# Altium schematic sheet Phase Inverter.SchDoc
size A; SheetNumber: 4; SheetTotal: 4
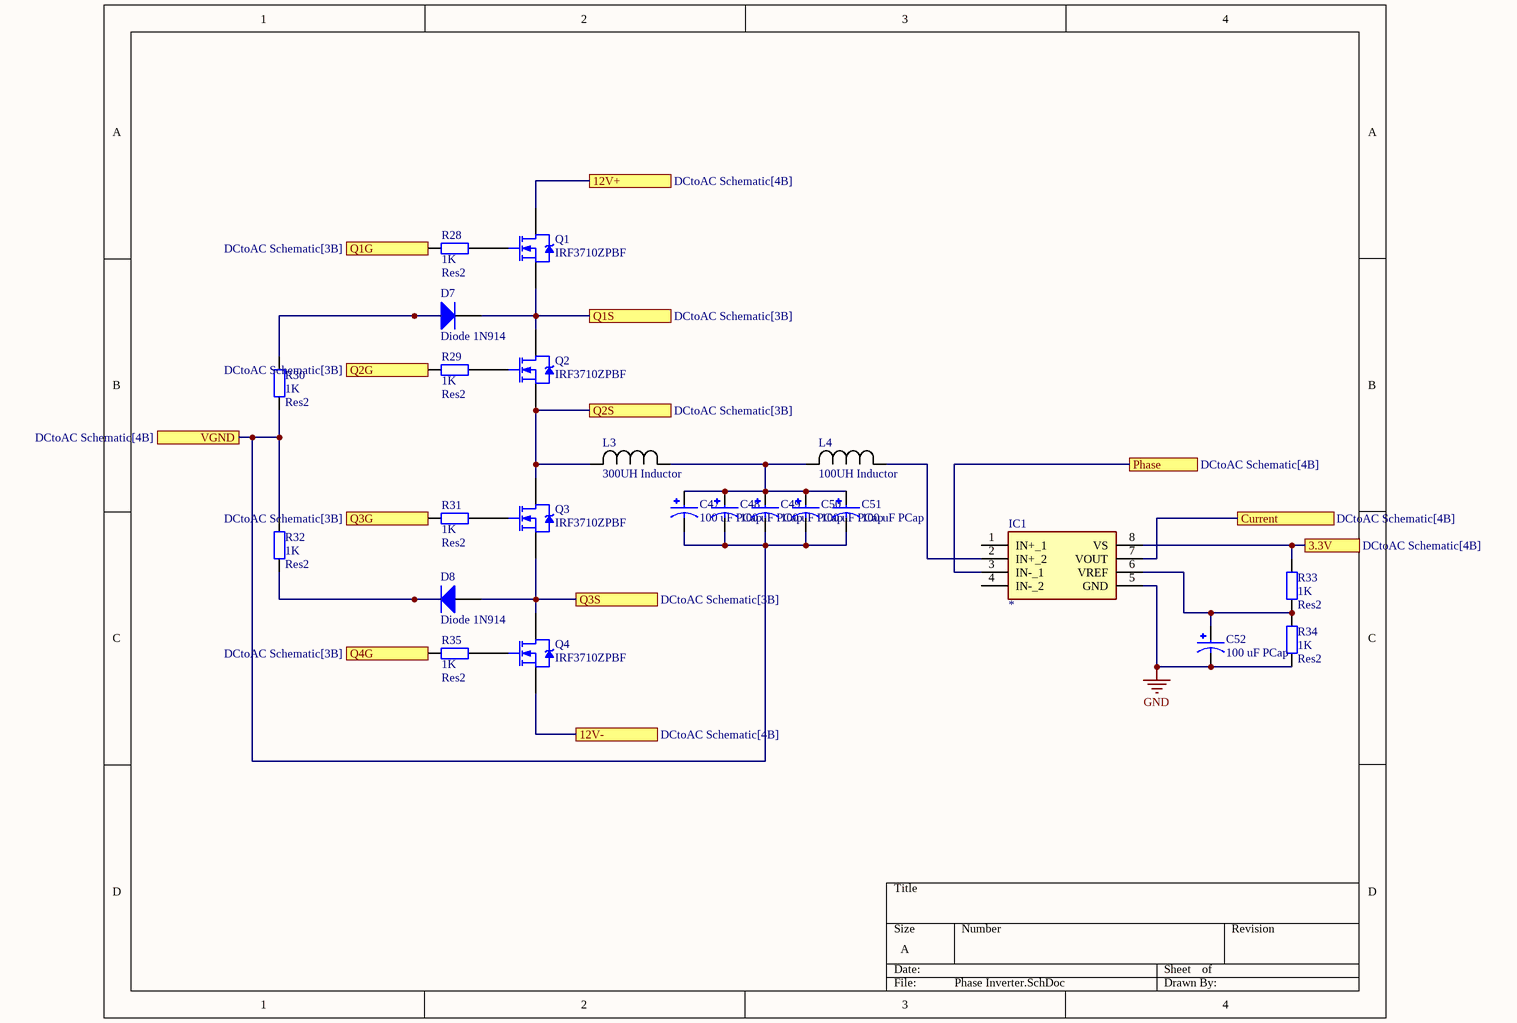
[diagram p0: Phase Inverter.SchDoc]

## Parts
C47  100 uF PCap  [100uF PCap]
C48  100 uF PCap  [100uF PCap]
C49  100 uF PCap  [100uF PCap]
C50  100 uF PCap  [100uF PCap]
C51  100 uF PCap  [100uF PCap]
C52  100 uF PCap  [100uF PCap]
D7  Diode 1N914  [DO-35]
D8  Diode 1N914  [DO-35]
IC1  *  [SOIC127P600X175-8N]
L3  300UH Inductor  [1430450C_MUR]
L4  100UH Inductor  [1410460C_MUR]
Q1  IRF3710ZPBF  [PG-TO220-3_INF]
Q2  IRF3710ZPBF  [PG-TO220-3_INF]
Q3  IRF3710ZPBF  [PG-TO220-3_INF]
Q4  IRF3710ZPBF  [PG-TO220-3_INF]
R28  Res2  value 1K  [AXIAL-0.4]
R29  Res2  value 1K  [AXIAL-0.4]
R30  Res2  value 1K  [AXIAL-0.4]
R31  Res2  value 1K  [AXIAL-0.4]
R32  Res2  value 1K  [AXIAL-0.4]
R33  Res2  value 1K  [AXIAL-0.4]
R34  Res2  value 1K  [AXIAL-0.4]
R35  Res2  value 1K  [AXIAL-0.4]

## Ports
3.3V (see DCtoAC Schematic[4B]), 12V+ (see DCtoAC Schematic[4B]), 12V- (see DCtoAC Schematic[4B]), Current (see DCtoAC Schematic[4B]), Phase (see DCtoAC Schematic[4B]), Q1G (see DCtoAC Schematic[3B]), Q1S (see DCtoAC Schematic[3B]), Q2G (see DCtoAC Schematic[3B]), Q2S (see DCtoAC Schematic[3B]), Q3G (see DCtoAC Schematic[3B]), Q3S (see DCtoAC Schematic[3B]), Q4G (see DCtoAC Schematic[3B]), VGND (see DCtoAC Schematic[4B])

## Nets
GND: C52.N IC1.5(GND) R34.2
3.3V: IC1.8(VS) R33.1 ; port 3.3V
12V+: Q1.2(D) ; port 12V+
12V-: Q4.3(S) ; port 12V-
Current: IC1.7(VOUT) ; port Current
Phase: IC1.3(IN-_1) ; port Phase
Q1G: R28.1 ; port Q1G
Q1S: D7.2(K) Q1.3(S) Q2.2(D) ; port Q1S
Q2G: R29.1 ; port Q2G
Q2S: L3.2 Q2.3(S) Q3.2(D) ; port Q2S
Q3G: R31.1 ; port Q3G
Q3S: D8.1(A) Q3.3(S) Q4.2(D) ; port Q3S
Q4G: R35.1 ; port Q4G
VGND: C47.N C48.N C49.N C50.N C51.N R30.1 R32.2 ; port VGND
NetC47_P: C47.P C48.P C49.P C50.P C51.P L3.1 L4.2
NetC52_P: C52.P IC1.6(VREF) R33.2 R34.1
NetD7_1: D7.1(A) R30.2
NetD8_2: D8.2(K) R32.1
NetIC1_2: IC1.2(IN+_2) L4.1
NetQ1_1: Q1.1(G) R28.2
NetQ2_1: Q2.1(G) R29.2
NetQ3_1: Q3.1(G) R31.2
NetQ4_1: Q4.1(G) R35.2

Not connected (* = marked no-connect by the designer): IC1 1(IN+_1) 4(IN-_2)

## Library data of the parts
C47-C52 = 100 uF PCap: Capacitor; Aluminum Electrolytic; Radial Al Electrolytic Cap; 100uF 63V; MF: Panasonic Electronic; MP: EEU-FC1J101; Package: RADIAL-2 Panasonic; Price: None; Check_prices: https://www.snapeda.com/parts/EEU-FC1J101/Panasonic%20Electronic%20Components/view-part/494707/?ref=eda; Value: *; SnapEDA_Link: https://www.snapeda.com/parts/EEU-FC1J101/Panasonic%20Electronic%20Components/view-part/494707/?ref=snap; Availability: In Stock
D7 D8 = Diode 1N914: High Conductance Fast Diode; Published: 8-Jun-2000; LatestRevisionDate: 17-Jul-2002; LatestRevisionNote: Re-released for DXP Platform.; DatasheetVersion: 1997; PackageReference: DO-35; Publisher: Altium Limited; PackageDescription: Diode, Axial; Body 3.8 x 1.9 mm (LxDia. max), Lead Dia. 0.53 mm (max); Code_JEDEC: DO-204-AH; ComponentLink1Description: Manufacturer Link; ComponentLink1URL: http://www.fairchildsemi.com/; ComponentLink2Description: Datasheet; ComponentLink2URL: http://www.fairchildsemi.com/ds/1N%2F1N4448.pdf
IC1 = TMCS1100A2QDR: Integrated Circuit; Manufacturer_Name: Texas Instruments; Description: Board Mount Current Sensors Precision isolated current sensor with external reference; Datasheet Link: https://www.ti.com/lit/gpn/TMCS1100; Height: 1.75mm; Manufacturer_Part_Number: TMCS1100A2QDR; Mouser Part Number: 595-TMCS1100A2QDR; Mouser Price/Stock: https://www.mouser.co.uk/ProductDetail/Texas-Instruments/TMCS1100A2QDR?qs=sPbYRqrBIVnDChUnLpnImg%3D%3D; Arrow Part Number: TMCS1100A2QDR; Arrow Price/Stock: https://www.arrow.com/en/products/tmcs1100a2qdr/texas-instruments?utm_currency=USD&region=nac
L3 = 300UH Inductor: Mfr_Name: Murata
L4 = 100UH Inductor: Mfr_Name: Murata
Q1-Q4 = IRF3710ZPBF: N-Channel Power MOSFET; Note: Pin 2 is electrically connected to pin 4.; Published: 8-Jun-2000; LatestRevisionDate: 17-Jul-2002; LatestRevisionNote: Re-released for DXP Platform.; DatasheetVersion: PD-9.814; PackageVersion: Feb-1997; PackageReference: TO-220AB; Publisher: Altium Limited; PackageDescription: TO, Thru-Hole, Vertical, Heatsink Mounted; 3 In-Line Leads; Pitch 2.54 mm; ComponentLink1Description: Manufacturer Link; ComponentLink1URL: http://www.irf.com/
R28-R35 = Res2: Resistor; Published: 8-Jun-2000; LatestRevisionDate: 17-Jul-2002; LatestRevisionNote: Re-released for DXP Platform.; PackageReference: AXIAL-0.4; Publisher: Altium Limited; PackageDescription: Axial Device, Thru-Hole; 2 Leads; 0.4 in Pin Spacing